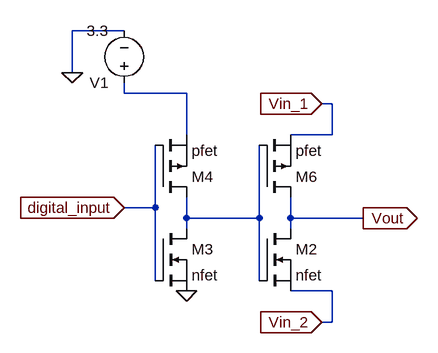
[diagram p0: schematic switch.asc]
switch.asc, the LTspice schematic file:
Version 4
SHEET 1 952 680
WIRE -112 -112 -192 -112
WIRE -192 -48 -192 -112
WIRE -112 -16 -112 -32
WIRE -16 -16 -112 -16
WIRE 208 0 192 0
WIRE -16 48 -16 -16
WIRE 208 48 208 0
WIRE 208 48 144 48
WIRE -64 160 -64 64
WIRE -64 160 -112 160
WIRE -16 176 -16 144
WIRE 96 176 96 64
WIRE 96 176 -16 176
WIRE 144 176 144 144
WIRE 256 176 144 176
WIRE -16 192 -16 176
WIRE 144 192 144 176
WIRE -64 272 -64 160
WIRE 96 272 96 176
WIRE 208 288 144 288
WIRE 208 336 208 288
WIRE 208 336 192 336
FLAG -16 288 0
FLAG -112 160 digital_input
IOPIN -112 160 In
FLAG 192 0 Vin_1
IOPIN 192 0 In
FLAG 192 336 Vin_2
IOPIN 192 336 In
FLAG 256 176 Vout
IOPIN 256 176 Out
FLAG -192 -48 0
SYMBOL voltage -112 -16 R180
WINDOW 123 0 0 Left 0
WINDOW 39 0 0 Left 0
SYMATTR InstName V1
SYMATTR Value 3.3
SYMBOL nmos 96 192 R0
SYMATTR InstName M2
SYMATTR Value nfet
SYMBOL nmos -64 192 R0
SYMATTR InstName M3
SYMATTR Value nfet
SYMBOL pmos -64 144 M180
SYMATTR InstName M4
SYMATTR Value pfet
SYMBOL pmos 96 144 M180
SYMATTR InstName M6
SYMATTR Value pfet

The netlist it stands for:
* switch.asc
V1 N001 0 3.3
M2 Vout N002 Vin_2 Vin_2 nfet
M3 N002 digital_input 0 0 nfet
M4 N002 digital_input N001 N001 pfet
M6 Vout N002 Vin_1 Vin_1 pfet
.model NMOS NMOS
.model PMOS PMOS
.lib standard.mos
.backanno
.end